# Altium schematic sheet Main.SchDoc
size A4; SheetNumber: 1; SheetTotal: 4
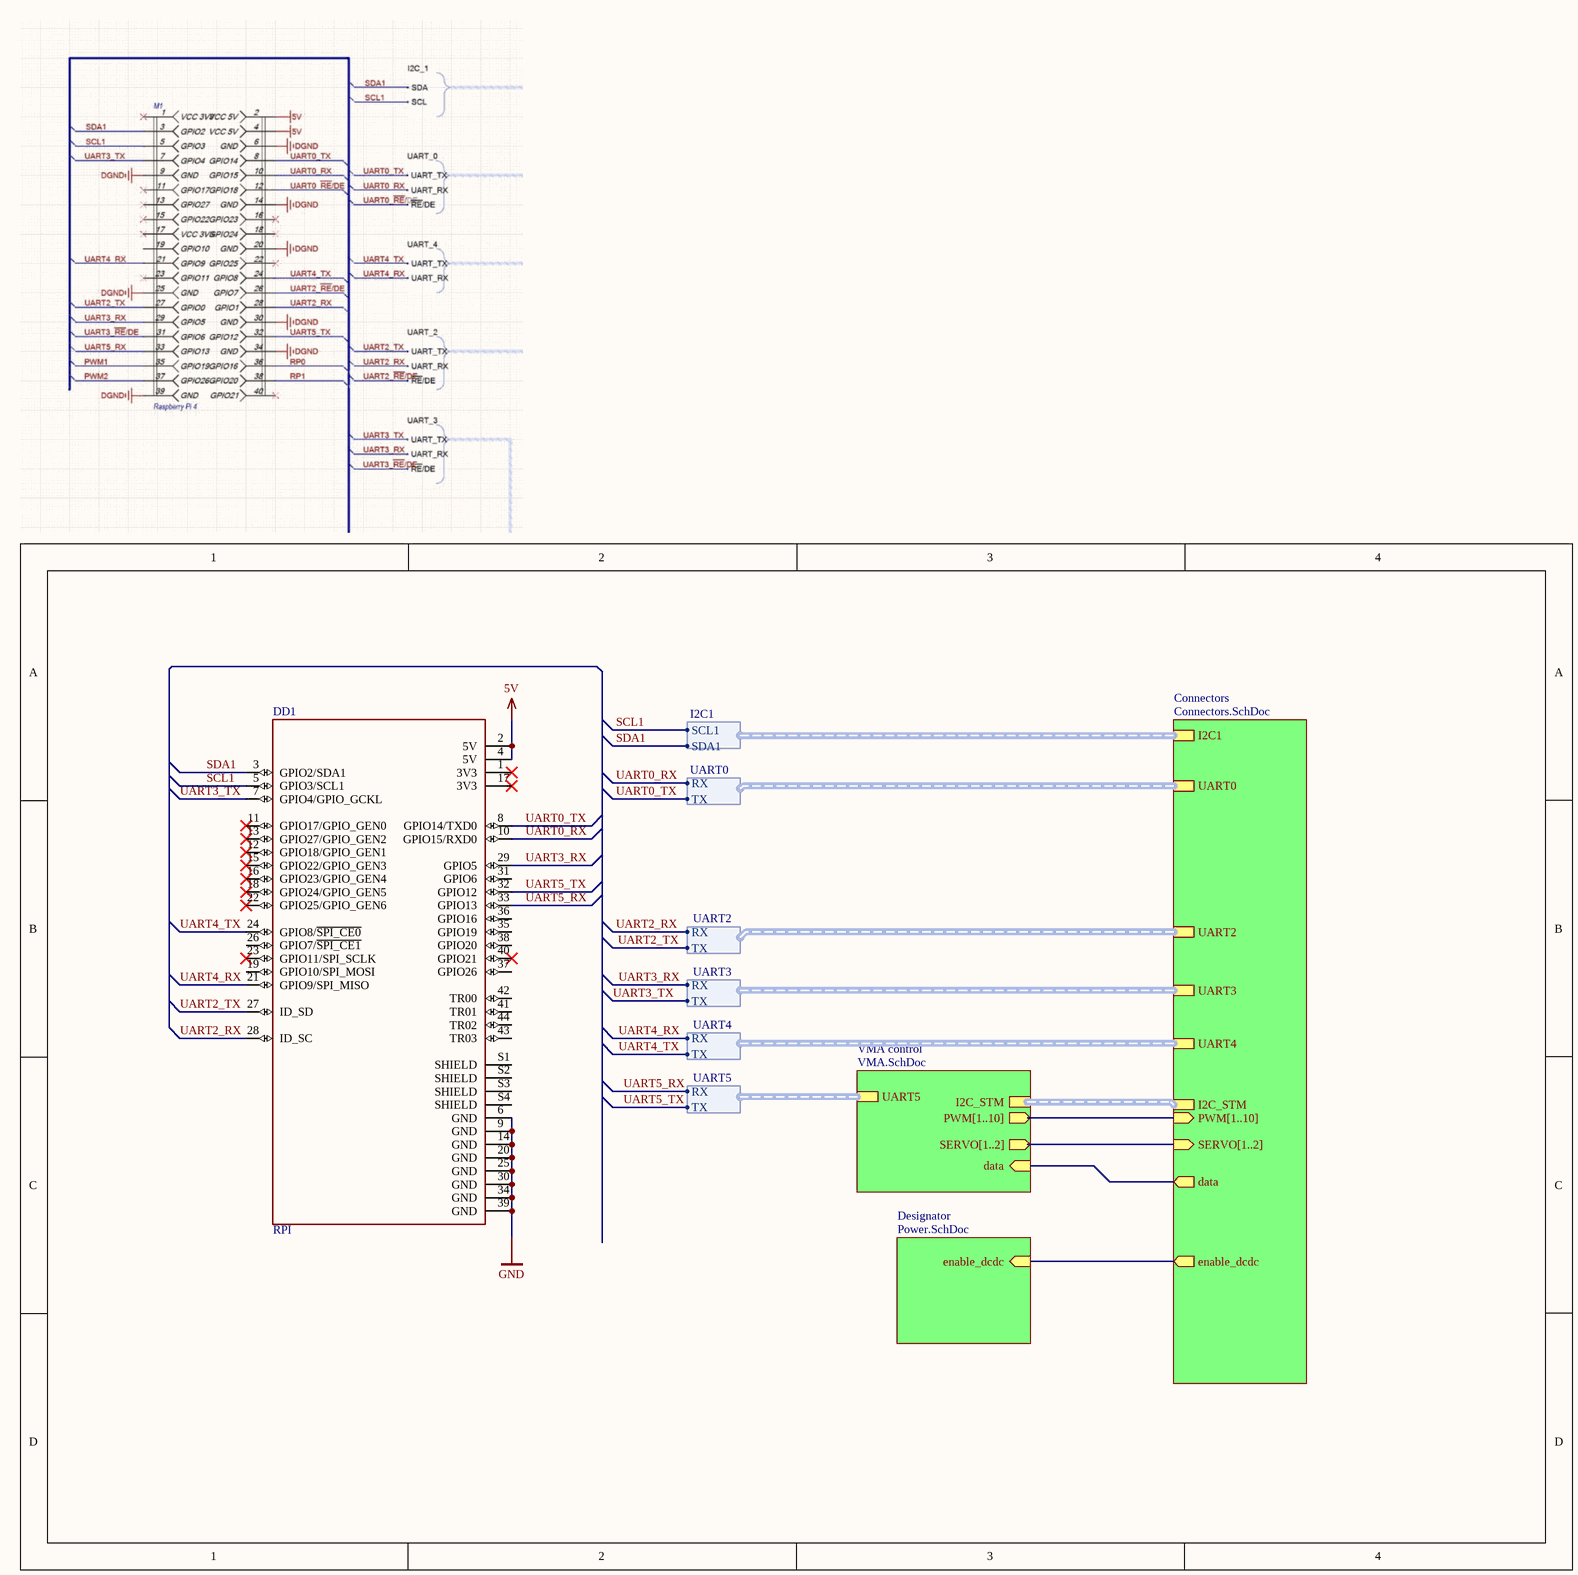
[diagram p0: Main.SchDoc]

## Parts
DD1  RPI  [RPI]

## Sub-sheets
Connectors = Connectors.SchDoc: PWM[1..10] (in), SERVO[1..2] (in), I2C1 (harness I2C1), UART3 (harness UART3), UART0 (harness UART0), UART2 (harness UART2), I2C_STM (harness I2C_STM), UART4 (harness UART4), enable_dcdc (out), data (out)
Designator = Power.SchDoc: enable_dcdc (in)
VMA control = VMA.SchDoc: UART5 (harness UART5), I2C_STM (harness I2C_STM), PWM[1..10] (out), SERVO[1..2] (out), data (in)

## Harnesses
I2C1: SCL1, SDA1
UART0: RX, TX
UART2: RX, TX
UART3: RX, TX
UART4: RX, TX
UART5: RX, TX

## Nets
5V: DD1.2(5V) DD1.4(5V)
GND: DD1.6(GND) DD1.9(GND) DD1.14(GND) DD1.20(GND) DD1.25(GND) DD1.30(GND) DD1.34(GND) DD1.39(GND)
SCL1: DD1.5(GPIO3/SCL1) ; sheet Connectors/I2C1.SCL1
SDA1: DD1.3(GPIO2/SDA1) ; sheet Connectors/I2C1.SDA1
UART0_RX: DD1.10(GPIO15/RXD0) ; sheet Connectors/UART0.RX
UART0_TX: DD1.8(GPIO14/TXD0) ; sheet Connectors/UART0.TX
UART2_RX: DD1.28(ID_SC) ; sheet Connectors/UART2.RX
UART2_TX: DD1.27(ID_SD) ; sheet Connectors/UART2.TX
UART3_RX: DD1.29(GPIO5) ; sheet Connectors/UART3.RX
UART3_TX: DD1.7(GPIO4/GPIO_GCKL) ; sheet Connectors/UART3.TX
UART4_RX: DD1.21(GPIO9/SPI_MISO) ; sheet Connectors/UART4.RX
UART4_TX: DD1.24(GPIO8/~{SPI_CE0}) ; sheet Connectors/UART4.TX
UART5_RX: DD1.33(GPIO13) ; sheet VMA control/UART5.RX
UART5_TX: DD1.32(GPIO12) ; sheet VMA control/UART5.TX
(unnamed): sheet VMA control/data, sheet Connectors/data
(unnamed): sheet Connectors/enable_dcdc, sheet Designator/enable_dcdc

Not connected (* = marked no-connect by the designer): DD1 1(3V3)* 11(GPIO17/GPIO_GEN0)* 12(GPIO18/GPIO_GEN1)* 13(GPIO27/GPIO_GEN2)* 15(GPIO22/GPIO_GEN3)* 16(GPIO23/GPIO_GEN4)* 17(3V3)* 18(GPIO24/GPIO_GEN5)* 19(GPIO10/SPI_MOSI) 22(GPIO25/GPIO_GEN6)* 23(GPIO11/SPI_SCLK)* 26(GPIO7/~{SPI_CE1}) 31(GPIO6) 35(GPIO19) 36(GPIO16) 37(GPIO26) 38(GPIO20) 40(GPIO21)* 41(TR01) 42(TR00) 43(TR03) 44(TR02) S1(SHIELD) S2(SHIELD) S3(SHIELD) S4(SHIELD)

## Buses and harness runs
bus sheet Connectors/PWM[1..10] = sheet VMA control/PWM[1..10]
bus sheet Connectors/SERVO[1..2] = sheet VMA control/SERVO[1..2]
harness sheet Connectors/I2C_STM = sheet VMA control/I2C_STM

## Library data of the parts
DD1 = RPI: Part Number: RPI